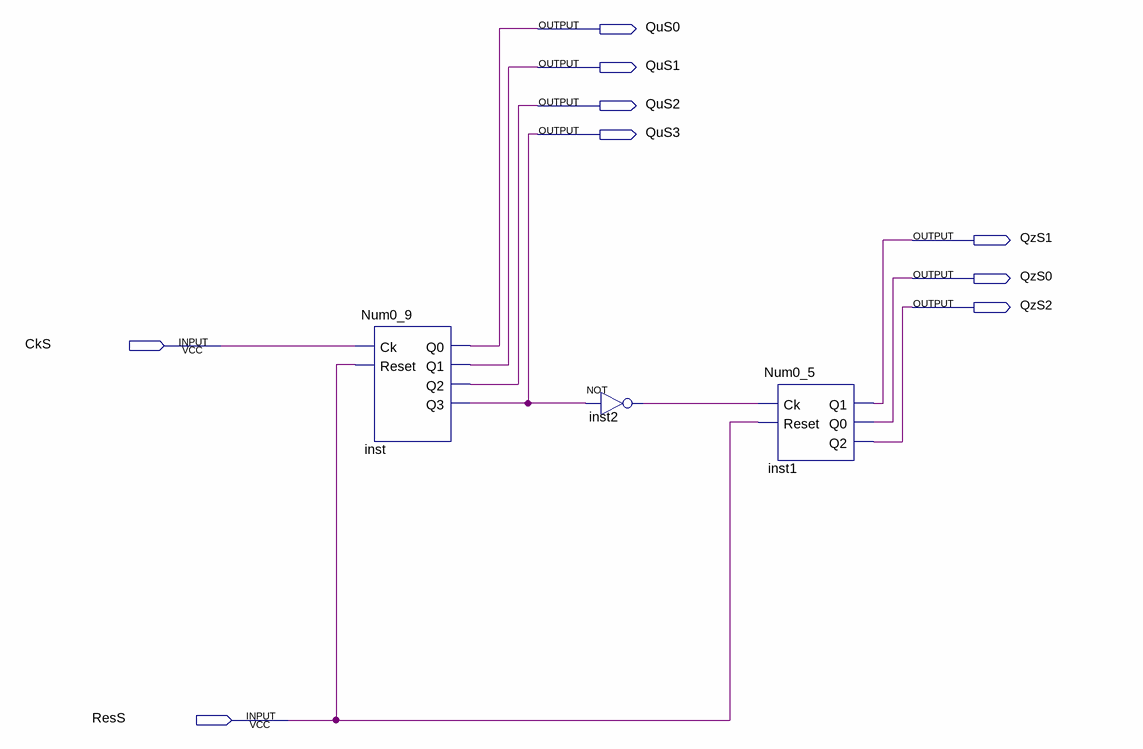
[diagram p0: schematic sheet]
// Quartus schematic NumS.bdf as structural Verilog: 3 symbols, 9 pins
module NumS (
  input  CkS,
  input  ResS,
  output QuS0,
  output QuS1,
  output QuS2,
  output QuS3,
  output QzS1,
  output QzS0,
  output QzS2
);

  wire inst2_out;

  Num0_9 inst (.Ck(CkS), .Reset(ResS), .Q0(QuS0), .Q1(QuS1), .Q2(QuS2), .Q3(QuS3));
  not inst2 (inst2_out, QuS3);
  Num0_5 inst1 (.Ck(inst2_out), .Reset(ResS), .Q1(QzS1), .Q0(QzS0), .Q2(QzS2));
endmodule
